# Altium schematic sheet SHDN-IMD-S02-V00-IMDConnection.SchDoc: IMD Connection
size A3; DrawnBy: Alikhan Hassan; DocumentNumber: 6; Revision: 00; SheetNumber: 6; SheetTotal: 6; Version: 01; Project: IMD Daughter Board 2020
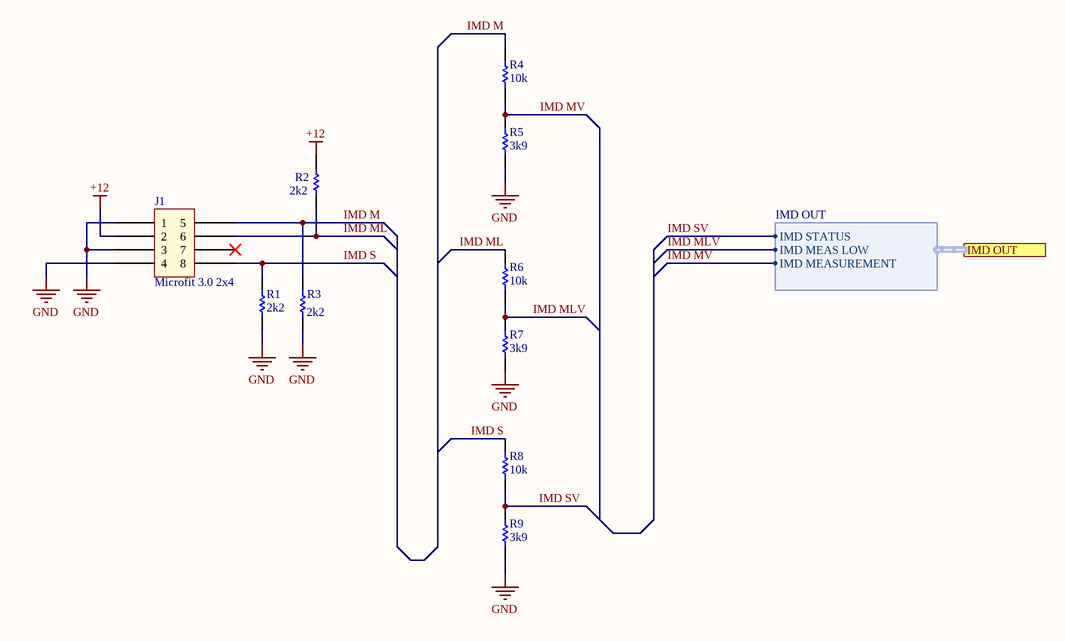
[diagram p0: SHDN-IMD-S02-V00-IMDConnection.SchDoc]

## Parts
J1  Microfit 3.0 2x4  [Microfit_2X4_R_TH]
R1  2k2  [Res_ThinFilm_0603]
R2  2k2  [Res_ThinFilm_0603]
R3  2k2  [Res_ThinFilm_0603]
R4  10k  [Res_ThinFilm_0603]
R5  3k9  [Res_ThinFilm_0603]
R6  10k  [Res_ThinFilm_0603]
R7  3k9  [Res_ThinFilm_0603]
R8  10k  [Res_ThinFilm_0603]
R9  3k9  [Res_ThinFilm_0603]

## Ports
IMD OUT (harness IMD OUT)

## Harnesses
IMD OUT: IMD MEASUREMENT, IMD MEAS LOW, IMD STATUS

## Nets
+12: J1.2 R2.2
GND: J1.1 J1.3 J1.4 R1.1 R3.1 R5.1 R7.1 R9.1
IMD M: J1.5 R3.2 R4.2
IMD ML: J1.6 R2.1 R6.2
IMD MLV: R6.1 R7.2 ; port IMD OUT.IMD MEAS LOW
IMD MV: R4.1 R5.2 ; port IMD OUT.IMD MEASUREMENT
IMD S: J1.8 R1.2 R8.2
IMD SV: R8.1 R9.2 ; port IMD OUT.IMD STATUS

Not connected (* = marked no-connect by the designer): J1 7*

## Notes on the sheet
- Revision History:
- Sheet Title:
- Rev
- Date
- Description
- Project:
- Size:
- Drawn By:
- A3
- Number:
- Revision:
- Sheet
- Version:
- of
- QUT Motorsport
- O-120, Gardens Point
- 2 George Street
- Brisbane, QLD 4000
- Australia
- Print Date:
- Print Time:
- File Name:

## Library data of the parts
J1 = Microfit_2x4
R1-R3 = 2k2 5% 0603: Resistor, SMD, 2k2, 0.1W, 5%, 0603
R4 R6 R8 = 10k 1% 0603: Resistor, SMD, 10k, 0.1W, 1%, 0603
R5 R7 R9 = 3k9 5% 0603: Resistor, SMD, 3k9, 0.1W, 5%, 0603